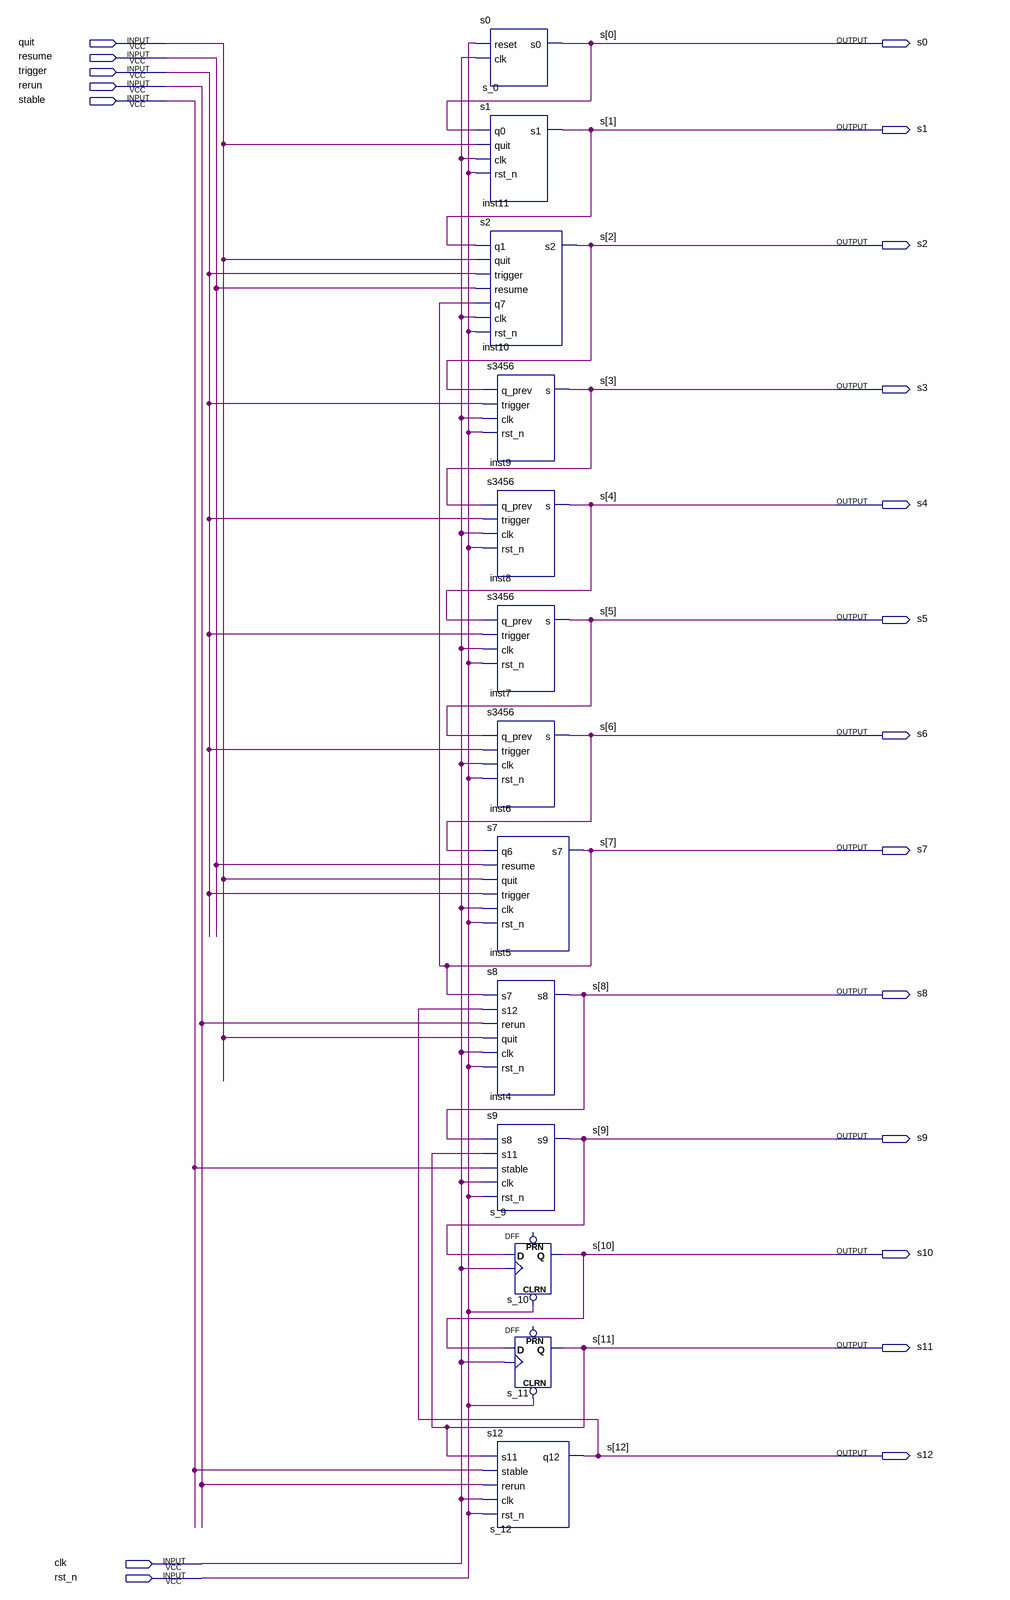
[diagram p0: schematic sheet]
// Quartus schematic ControlUnit - 복사본.bdf as structural Verilog: 13 symbols, 20 pins
module \ControlUnit_-_복사본  (
  input  quit,
  input  resume,
  input  trigger,
  input  rerun,
  input  stable,
  input  clk,
  input  rst_n,
  output s0,
  output s1,
  output s2,
  output s3,
  output s4,
  output s5,
  output s6,
  output s7,
  output s8,
  output s9,
  output s10,
  output s11,
  output s12
);

  s0 s_0 (.reset(rst_n), .clk(clk), .s0(s0));
  s1 inst11 (.q0(s0), .quit(quit), .clk(clk), .rst_n(rst_n), .s1(s1));
  s2 inst10 (.q1(s1), .quit(quit), .trigger(trigger), .resume(resume), .q7(s7), .clk(clk), .rst_n(rst_n), .s2(s2));
  s3456 inst9 (.q_prev(s2), .trigger(trigger), .clk(clk), .rst_n(rst_n), .s(s3));
  s3456 inst8 (.q_prev(s3), .trigger(trigger), .clk(clk), .rst_n(rst_n), .s(s4));
  s3456 inst7 (.q_prev(s4), .trigger(trigger), .clk(clk), .rst_n(rst_n), .s(s5));
  s3456 inst6 (.q_prev(s5), .trigger(trigger), .clk(clk), .rst_n(rst_n), .s(s6));
  s7 inst5 (.q6(s6), .resume(resume), .quit(quit), .trigger(trigger), .clk(clk), .rst_n(rst_n), .s7(s7));
  s8 inst4 (.s7(s7), .s12(s12), .rerun(rerun), .quit(quit), .clk(clk), .rst_n(rst_n), .s8(s8));
  s9 s_9 (.s8(s8), .s11(s11), .stable(stable), .clk(clk), .rst_n(rst_n), .s9(s9));
  DFF s_10 (.CLRN(rst_n), .CLK(clk), .D(s9), .Q(s10));  // open: PRN
  DFF s_11 (.CLRN(rst_n), .CLK(clk), .D(s10), .Q(s11));  // open: PRN
  s12 s_12 (.s11(s11), .stable(stable), .rerun(rerun), .clk(clk), .rst_n(rst_n), .q12(s12));
endmodule
